# Altium project 通信1803-201806061211-凌智城.PrjPcb
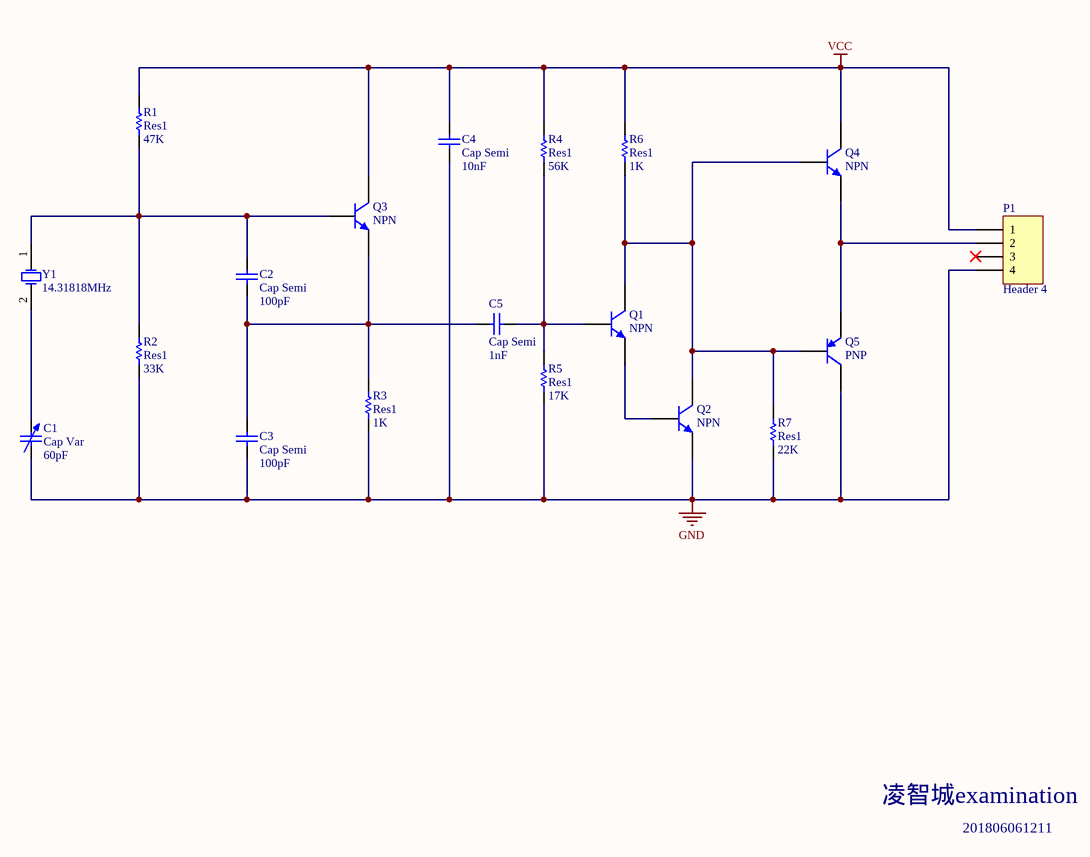
[diagram p0: exam.SchDoc]
1 sheet, 19 parts. Net scope: global (net labels, ports and power ports of the same name join across sheets).
Board file: exam.PcbDoc

## Sheet exam.SchDoc
size A4

### Parts
C1  Cap Var  value 60pF  [C1210_N]
C2  Cap Semi  value 100pF  [C1206]
C3  Cap Semi  value 100pF  [C1206]
C4  Cap Semi  value 10nF  [C1206]
C5  Cap Semi  value 1nF  [C1206]
P1  Header 4  [HDR1X4]
Q1  NPN  [TO-226-AA]
Q2  NPN  [TO-226-AA]
Q3  NPN  [TO-226-AA]
Q4  NPN  [TO-226-AA]
Q5  PNP  [SOT-23B_N]
R1  Res1  value 47K  [AXIAL-0.3]
R2  Res1  value 33K  [AXIAL-0.3]
R3  Res1  value 1K  [AXIAL-0.3]
R4  Res1  value 56K  [AXIAL-0.3]
R5  Res1  value 17K  [AXIAL-0.3]
R6  Res1  value 1K  [AXIAL-0.3]
R7  Res1  value 22K  [AXIAL-0.3]
Y1  14.31818MHz  [R38]

### Nets
GND: C1.1 C3.1 C4.1 P1.4 Q2.3(E) Q5.1(C) R2.1 R3.1 R5.1 R7.1
VCC: C4.2 P1.1 Q3.1(C) Q4.1(C) R1.2 R4.2 R6.2
NetC1_2: C1.2 Y1.2(OSC2)
NetC2_1: C2.1 C3.2 C5.1 Q3.3(E) R3.2
NetC2_2: C2.2 Q3.2(B) R1.1 R2.2 Y1.1(OSC1)
NetC5_2: C5.2 Q1.2(B) R4.1 R5.2
NetP1_2: P1.2 Q4.3(E) Q5.3(E)
NetQ1_1: Q1.1(C) Q2.1(C) Q4.2(B) Q5.2(B) R6.1 R7.2
NetQ1_3: Q1.3(E) Q2.2(B)

Not connected (* = marked no-connect by the designer): P1 3*

### Notes on the sheet
- 凌智城examination
- 201806061211

### Library data of the parts
C1 = Cap Var: Variable or Adjustable Capacitor; Published: 24-Mar-1999; LatestRevisionDate: 29-May-2009; LatestRevisionNote: IPC-7351 Footprint Added.; PackageReference: C1210; Publisher: Altium Limited; PackageDescription: Chip Capacitor 1210 Case Size; Code_JEITA: 1210; Code_IPC: CAPC3225
C2-C5 = Cap Semi: Capacitor (Semiconductor SIM Model); Published: 8-Jun-2000; LatestRevisionDate: 29-May-2009; LatestRevisionNote: IPC-7351 Footprint Added.; PackageReference: C1206; Publisher: Altium Limited; PackageDescription: Chip Capacitor
P1 = Header 4: Header, 4-Pin; LatestRevisionDate: 17-Jul-2002; LatestRevisionNote: Re-released for DXP Platform.; Publisher: Altium Limited
Q1-Q4 = NPN: NPN Bipolar Transistor; Published: 8-Jun-2000; LatestRevisionDate: 17-Jul-2002; LatestRevisionNote: Re-released for DXP Platform.; PackageReference: TO-226-AA; Publisher: Altium Limited; PackageDescription: TO, Flat Index; 3 In-Line, Axial Leads; Body Dia. 4.8mm; Leads 0.55 x 0.51 mm (max); Code_JEDEC: TO-226-AA
Q5 = PNP: PNP Bipolar Transistor; Published: 8-Jun-2000; LatestRevisionDate: 29-May-2009; LatestRevisionNote: IPC-7351 Footprint Added.; PackageVersion: Aug-1999; PackageReference: SOT-23B; Publisher: Altium Limited; PackageDescription: 3-Pin SOT-23 Package 0.95 mm Pitch, 2.4 mm Lead Span
R1-R7 = Res1: Resistor; Published: 8-Jun-2000; LatestRevisionDate: 17-Jul-2002; LatestRevisionNote: Re-released for DXP Platform.; PackageReference: AXIAL-0.3; Publisher: Altium Limited; PackageDescription: Axial Device, Thru-Hole; 2 Leads; 0.3 in Pin Spacing
Y1 = XTAL: Crystal Oscillator; Published: 8-Jun-2000; LatestRevisionDate: 17-Jul-2002; LatestRevisionNote: Re-released for DXP Platform.; PackageReference: R38; Publisher: Altium Limited; PackageDescription: Crystal, Thru-Hole; 2 Leads; Body 3.1 x 8.2 mm (Dia.xH)